# EAGLE design LEDMatrix_buffered (EAGLE 9.6.2)
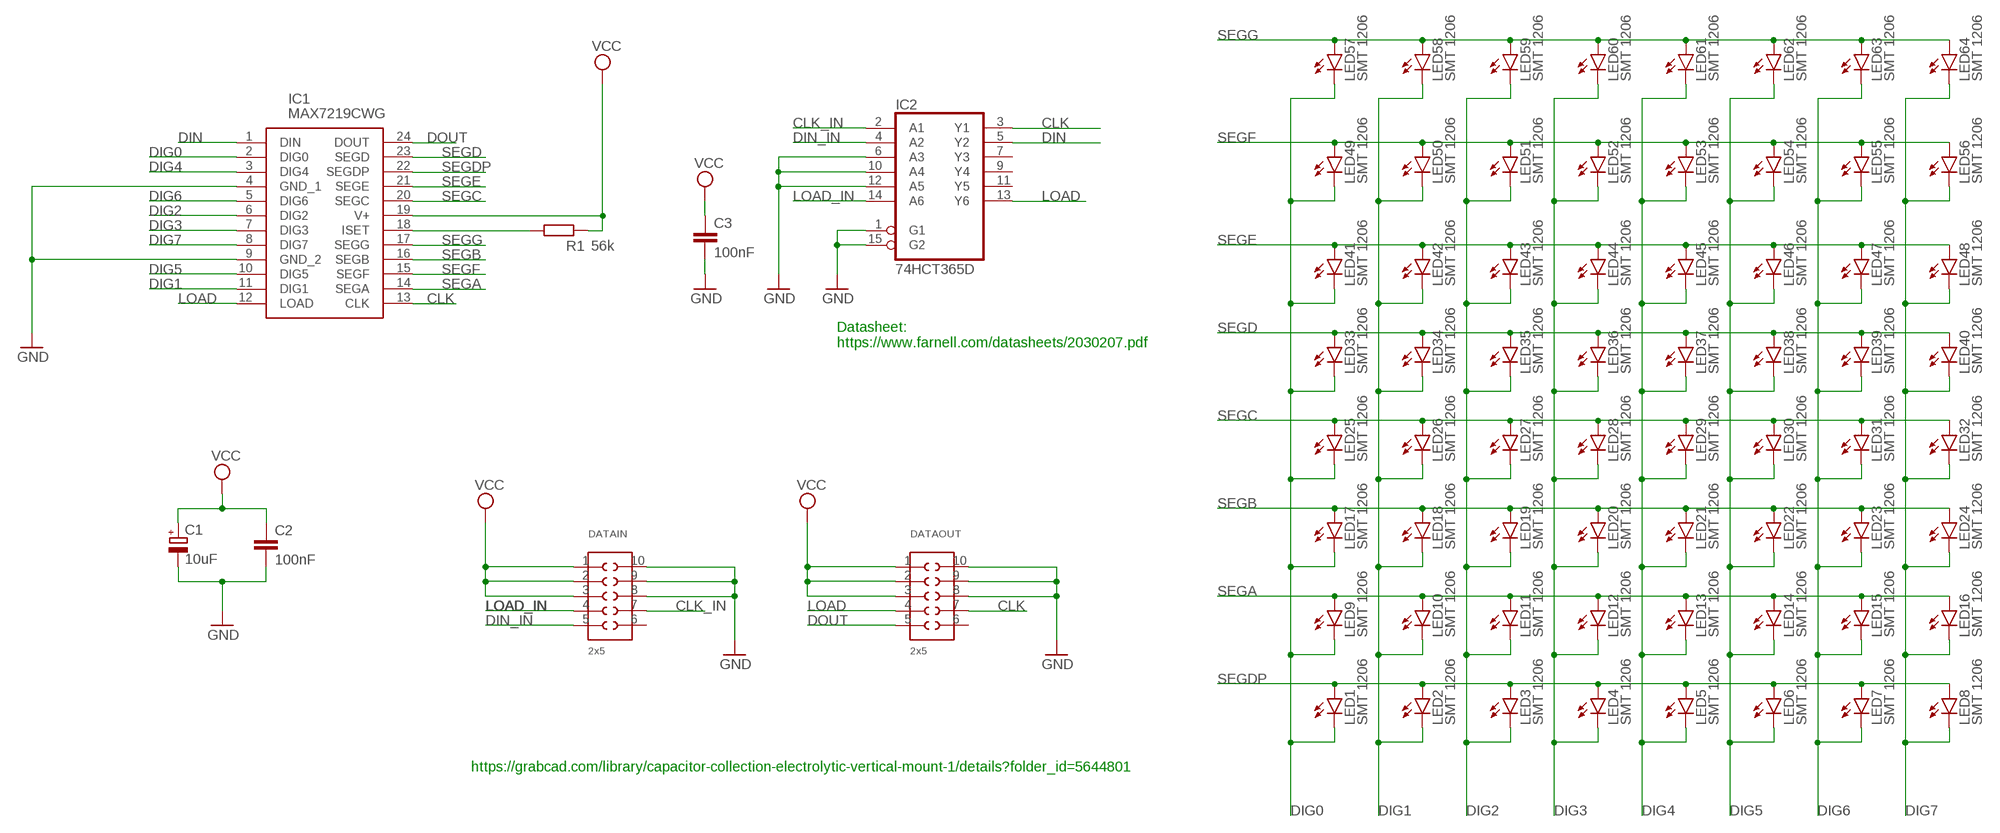
[diagram p0: schematic, sheet 1]

## Parts
C1  10uF  CPOL-EUE5-8.5  [E5-8,5]
C2  100nF  C-EUC1206  [C1206]
C3  100nF  C-EUC1206  [C1206]
DATAIN  2x5  610X1021121  [610X1021121]
DATAOUT  2x5  610X1021121  [610X1021121]
IC1  MAX7219CWG  [SOIC127P1032X265-24N]
IC2  74HCT365D  [SO16]
LED1  SMT 1206  LEDCHIPLED_1206  [CHIPLED_1206]
LED2  SMT 1206  LEDCHIPLED_1206  [CHIPLED_1206]
LED3  SMT 1206  LEDCHIPLED_1206  [CHIPLED_1206]
LED4  SMT 1206  LEDCHIPLED_1206  [CHIPLED_1206]
LED5  SMT 1206  LEDCHIPLED_1206  [CHIPLED_1206]
LED6  SMT 1206  LEDCHIPLED_1206  [CHIPLED_1206]
LED7  SMT 1206  LEDCHIPLED_1206  [CHIPLED_1206]
LED8  SMT 1206  LEDCHIPLED_1206  [CHIPLED_1206]
LED9  SMT 1206  LEDCHIPLED_1206  [CHIPLED_1206]
LED10  SMT 1206  LEDCHIPLED_1206  [CHIPLED_1206]
LED11  SMT 1206  LEDCHIPLED_1206  [CHIPLED_1206]
LED12  SMT 1206  LEDCHIPLED_1206  [CHIPLED_1206]
LED13  SMT 1206  LEDCHIPLED_1206  [CHIPLED_1206]
LED14  SMT 1206  LEDCHIPLED_1206  [CHIPLED_1206]
LED15  SMT 1206  LEDCHIPLED_1206  [CHIPLED_1206]
LED16  SMT 1206  LEDCHIPLED_1206  [CHIPLED_1206]
LED17  SMT 1206  LEDCHIPLED_1206  [CHIPLED_1206]
LED18  SMT 1206  LEDCHIPLED_1206  [CHIPLED_1206]
LED19  SMT 1206  LEDCHIPLED_1206  [CHIPLED_1206]
LED20  SMT 1206  LEDCHIPLED_1206  [CHIPLED_1206]
LED21  SMT 1206  LEDCHIPLED_1206  [CHIPLED_1206]
LED22  SMT 1206  LEDCHIPLED_1206  [CHIPLED_1206]
LED23  SMT 1206  LEDCHIPLED_1206  [CHIPLED_1206]
LED24  SMT 1206  LEDCHIPLED_1206  [CHIPLED_1206]
LED25  SMT 1206  LEDCHIPLED_1206  [CHIPLED_1206]
LED26  SMT 1206  LEDCHIPLED_1206  [CHIPLED_1206]
LED27  SMT 1206  LEDCHIPLED_1206  [CHIPLED_1206]
LED28  SMT 1206  LEDCHIPLED_1206  [CHIPLED_1206]
LED29  SMT 1206  LEDCHIPLED_1206  [CHIPLED_1206]
LED30  SMT 1206  LEDCHIPLED_1206  [CHIPLED_1206]
LED31  SMT 1206  LEDCHIPLED_1206  [CHIPLED_1206]
LED32  SMT 1206  LEDCHIPLED_1206  [CHIPLED_1206]
LED33  SMT 1206  LEDCHIPLED_1206  [CHIPLED_1206]
LED34  SMT 1206  LEDCHIPLED_1206  [CHIPLED_1206]
LED35  SMT 1206  LEDCHIPLED_1206  [CHIPLED_1206]
LED36  SMT 1206  LEDCHIPLED_1206  [CHIPLED_1206]
LED37  SMT 1206  LEDCHIPLED_1206  [CHIPLED_1206]
LED38  SMT 1206  LEDCHIPLED_1206  [CHIPLED_1206]
LED39  SMT 1206  LEDCHIPLED_1206  [CHIPLED_1206]
LED40  SMT 1206  LEDCHIPLED_1206  [CHIPLED_1206]
LED41  SMT 1206  LEDCHIPLED_1206  [CHIPLED_1206]
LED42  SMT 1206  LEDCHIPLED_1206  [CHIPLED_1206]
LED43  SMT 1206  LEDCHIPLED_1206  [CHIPLED_1206]
LED44  SMT 1206  LEDCHIPLED_1206  [CHIPLED_1206]
LED45  SMT 1206  LEDCHIPLED_1206  [CHIPLED_1206]
LED46  SMT 1206  LEDCHIPLED_1206  [CHIPLED_1206]
LED47  SMT 1206  LEDCHIPLED_1206  [CHIPLED_1206]
LED48  SMT 1206  LEDCHIPLED_1206  [CHIPLED_1206]
LED49  SMT 1206  LEDCHIPLED_1206  [CHIPLED_1206]
LED50  SMT 1206  LEDCHIPLED_1206  [CHIPLED_1206]
LED51  SMT 1206  LEDCHIPLED_1206  [CHIPLED_1206]
LED52  SMT 1206  LEDCHIPLED_1206  [CHIPLED_1206]
LED53  SMT 1206  LEDCHIPLED_1206  [CHIPLED_1206]
LED54  SMT 1206  LEDCHIPLED_1206  [CHIPLED_1206]
LED55  SMT 1206  LEDCHIPLED_1206  [CHIPLED_1206]
LED56  SMT 1206  LEDCHIPLED_1206  [CHIPLED_1206]
LED57  SMT 1206  LEDCHIPLED_1206  [CHIPLED_1206]
LED58  SMT 1206  LEDCHIPLED_1206  [CHIPLED_1206]
LED59  SMT 1206  LEDCHIPLED_1206  [CHIPLED_1206]
LED60  SMT 1206  LEDCHIPLED_1206  [CHIPLED_1206]
LED61  SMT 1206  LEDCHIPLED_1206  [CHIPLED_1206]
LED62  SMT 1206  LEDCHIPLED_1206  [CHIPLED_1206]
LED63  SMT 1206  LEDCHIPLED_1206  [CHIPLED_1206]
LED64  SMT 1206  LEDCHIPLED_1206  [CHIPLED_1206]
R1  56k  R-EU_R1206  [R1206]

## Nets
CLK: DATAOUT.7 IC1.13(CLK) IC2.3(Y1)
CLK_IN: DATAIN.7 IC2.2(A1)
DIG0: IC1.2(DIG0) LED1.C LED9.C LED17.C LED25.C LED33.C LED41.C LED49.C LED57.C
DIG1: IC1.11(DIG1) LED2.C LED10.C LED18.C LED26.C LED34.C LED42.C LED50.C LED58.C
DIG2: IC1.6(DIG2) LED3.C LED11.C LED19.C LED27.C LED35.C LED43.C LED51.C LED59.C
DIG3: IC1.7(DIG3) LED4.C LED12.C LED20.C LED28.C LED36.C LED44.C LED52.C LED60.C
DIG4: IC1.3(DIG4) LED5.C LED13.C LED21.C LED29.C LED37.C LED45.C LED53.C LED61.C
DIG5: IC1.10(DIG5) LED6.C LED14.C LED22.C LED30.C LED38.C LED46.C LED54.C LED62.C
DIG6: IC1.5(DIG6) LED7.C LED15.C LED23.C LED31.C LED39.C LED47.C LED55.C LED63.C
DIG7: IC1.8(DIG7) LED8.C LED16.C LED24.C LED32.C LED40.C LED48.C LED56.C LED64.C
DIN: IC1.1(DIN) IC2.5(Y2)
DIN_IN: DATAIN.5 IC2.4(A2)
DOUT: DATAOUT.5 IC1.24(DOUT)
GND: C1.- C2.2 C3.2 DATAIN.8 DATAIN.9 DATAIN.10 DATAOUT.8 DATAOUT.9 DATAOUT.10 IC1.4(GND_1) IC1.9(GND_2) IC2.1(G1) IC2.6(A3) IC2.10(A4) IC2.12(A5) IC2.15(G2)
LOAD: DATAOUT.4 IC1.12(LOAD) IC2.13(Y6)
LOAD_IN: DATAIN.4 IC2.14(A6)
N$2: IC1.18(ISET) R1.1
SEGA: IC1.14(SEGA) LED9.A LED10.A LED11.A LED12.A LED13.A LED14.A LED15.A LED16.A
SEGB: IC1.16(SEGB) LED17.A LED18.A LED19.A LED20.A LED21.A LED22.A LED23.A LED24.A
SEGC: IC1.20(SEGC) LED25.A LED26.A LED27.A LED28.A LED29.A LED30.A LED31.A LED32.A
SEGD: IC1.23(SEGD) LED33.A LED34.A LED35.A LED36.A LED37.A LED38.A LED39.A LED40.A
SEGDP: IC1.22(SEGDP) LED1.A LED2.A LED3.A LED4.A LED5.A LED6.A LED7.A LED8.A
SEGE: IC1.21(SEGE) LED41.A LED42.A LED43.A LED44.A LED45.A LED46.A LED47.A LED48.A
SEGF: IC1.15(SEGF) LED49.A LED50.A LED51.A LED52.A LED53.A LED54.A LED55.A LED56.A
SEGG: IC1.17(SEGG) LED57.A LED58.A LED59.A LED60.A LED61.A LED62.A LED63.A LED64.A
VCC: C1.+ C2.1 C3.1 DATAIN.1 DATAIN.2 DATAIN.3 DATAOUT.1 DATAOUT.2 DATAOUT.3 IC1.19(V+) R1.2
Unconnected: DATAIN.6 DATAOUT.6 IC2.7(Y3) IC2.9(Y4) IC2.11(Y5)

## Notes on the sheet
- Datasheet:
  https://www.farnell.com/datasheets/2030207.pdf
- https://grabcad.com/library/capacitor-collection-electrolytic-vertical-mount-1/details?folder_id=5644801

## Power pins joined to a net without a drawn wire
GND: IC2.8(GND)
VCC: IC2.16(VCC)

## Library data of the parts
C1 = Clean-Kong:CPOL-EU: POLARIZED CAPACITOR, European symbol
C2 C3 = rcl:C-EU: CAPACITOR, European symbol; SPICEPREFIX: C
DATAIN DATAOUT = Wurth_Elektronik_Electromechanic_Board_to_Board_Connectors_rev16a:610X1021121: WR-PHD 2.54mm Dual SMT Pin Header, 10 Pins =>Code : Con_BTB_PHD_2.54_2_610x1021121(packageing:x = 0: Tube x = 3: Tape & Reel with Cap; 300 pcs/Reel) <http://katalog.we-online.de/media/images/eican/Con_BTB_PHD_2.54_2_6100xx21121_pf2.jpg> 6100xx21121 Details see: http://katalog.we-online.de/en/em/610_0xx_211_21 6103xx21121 Details see: http://katalog.we-online.de/en/em/PHD_2_54_SMT_DUAL_PIN_HEADER_REEL_6103XX21121 2014 (C) Würth Elektronik
IC1 = MAX7219CWG:MAX7219CWG: IC DRVR 7 SEGMNT 8 DIGIT 24SOIC Source: Datasheet <http://datasheets.maximintegrated.com/en/ds/MAX7219-MAX7221.pdf>; DESCRIPTION: IC DRVR 7 SEGMNT 8 DIGIT 24SOIC; HEIGHT: 2.65mm; MANUFACTURER_NAME: Maxim Integrated; MANUFACTURER_PART_NUMBER: MAX7219CWG
IC2 = 74xx-eu:74*365: Hex BUS DRIVER, 3-state; SPICEPREFIX: X
LED1-LED64 = led:LED: LED OSRAM: - CHIPLED LG R971, LG N971, LY N971, LG Q971, LY Q971, LO R971, LY R971 LH N974, LH R974 LS Q976, LO Q976, LY Q976 LO Q996 - Hyper CHIPLED LW Q18S LB Q993, LB Q99A, LB R99A - SideLED LS A670, LO A670, LY A670, LG A670, LP A670 LB A673, LV A673, LT A673, LW A673 LH A674 LY A675 LS A676, LA A676, LO A676, LY A676, LW A676 LS A679, LY A679, LG A679 - Hyper Micro SIDELED® LS Y876, LA Y876, LO Y876, LY Y876 LT Y87S - SmartLED LW L88C, LW L88S LB L89C, LB L89S, LG L890 LS L89K, LO L89K, LY L89K LS L896, LA L896, LO L896, LY L896 - TOPLED LS T670, LO T670, LY T670, LG T670, LP T670 LSG T670, LSP T670, LSY T670, LOP T670, LYG T670 LG T671, LOG T671, LSG T671 LB T673, LV T673, LT T673, LW T673 LH T674 LS T676, LA T676, LO T676, LY T676, LB T676, LH T676, LSB T676, LW T676 LB T67C, LV T67C, LT T67C, LS T67K, LO T67K, LY T67K, LW E67C LS E67B, LA E67B, LO E67B, LY E67B, LB E67C, LV E67C, LT E67C LW T67C LS T679, LY T679, LG T679 LS T770, LO T770, LY T770, LG T770, LP T770 LB T773, LV T773, LT T773, LW T773 LH T774 LS E675, LA E675, LY E675, LS T675 LS T776, LA T776, LO T776, LY T776, LB T776 LHGB T686 LT T68C, LB T68C - Hyper Mini TOPLED® LB M676 - Mini TOPLED Santana® LG M470 LS M47K, LO M47K, LY M47K Source: http://www.osram.convergy.de LUXEON: - LUMILED® LXK2-PW12-R00, LXK2-PW12-S00, LXK2-PW14-U00, LXK2-PW14-V00 LXK2-PM12-R00, LXK2-PM12-S00, LXK2-PM14-U00 LXK2-PE12-Q00, LXK2-PE12-R00, LXK2-PE12-S00, LXK2-PE14-T00, LXK2-PE14-U00 LXK2-PB12-K00, LXK2-PB12-L00, LXK2-PB12-M00, LXK2-PB14-N00, LXK2-PB14-P00, LXK2-PB14-Q00 LXK2-PR12-L00, LXK2-PR12-M00, LXK2-PR14-Q00, LXK2-PR14-R00 LXK2-PD12-Q00, LXK2-PD12-R00, LXK2-PD12-S00 LXK2-PH12-R00, LXK2-PH12-S00 LXK2-PL12-P00, LXK2-PL12-Q00, LXK2-PL12-R00 Source: www.luxeon.com KINGBRIGHT: KA-3528ASYC Source: www.kingbright.com
R1 = rcl:R-EU_: RESISTOR, European symbol; SPICEPREFIX: R

## Board
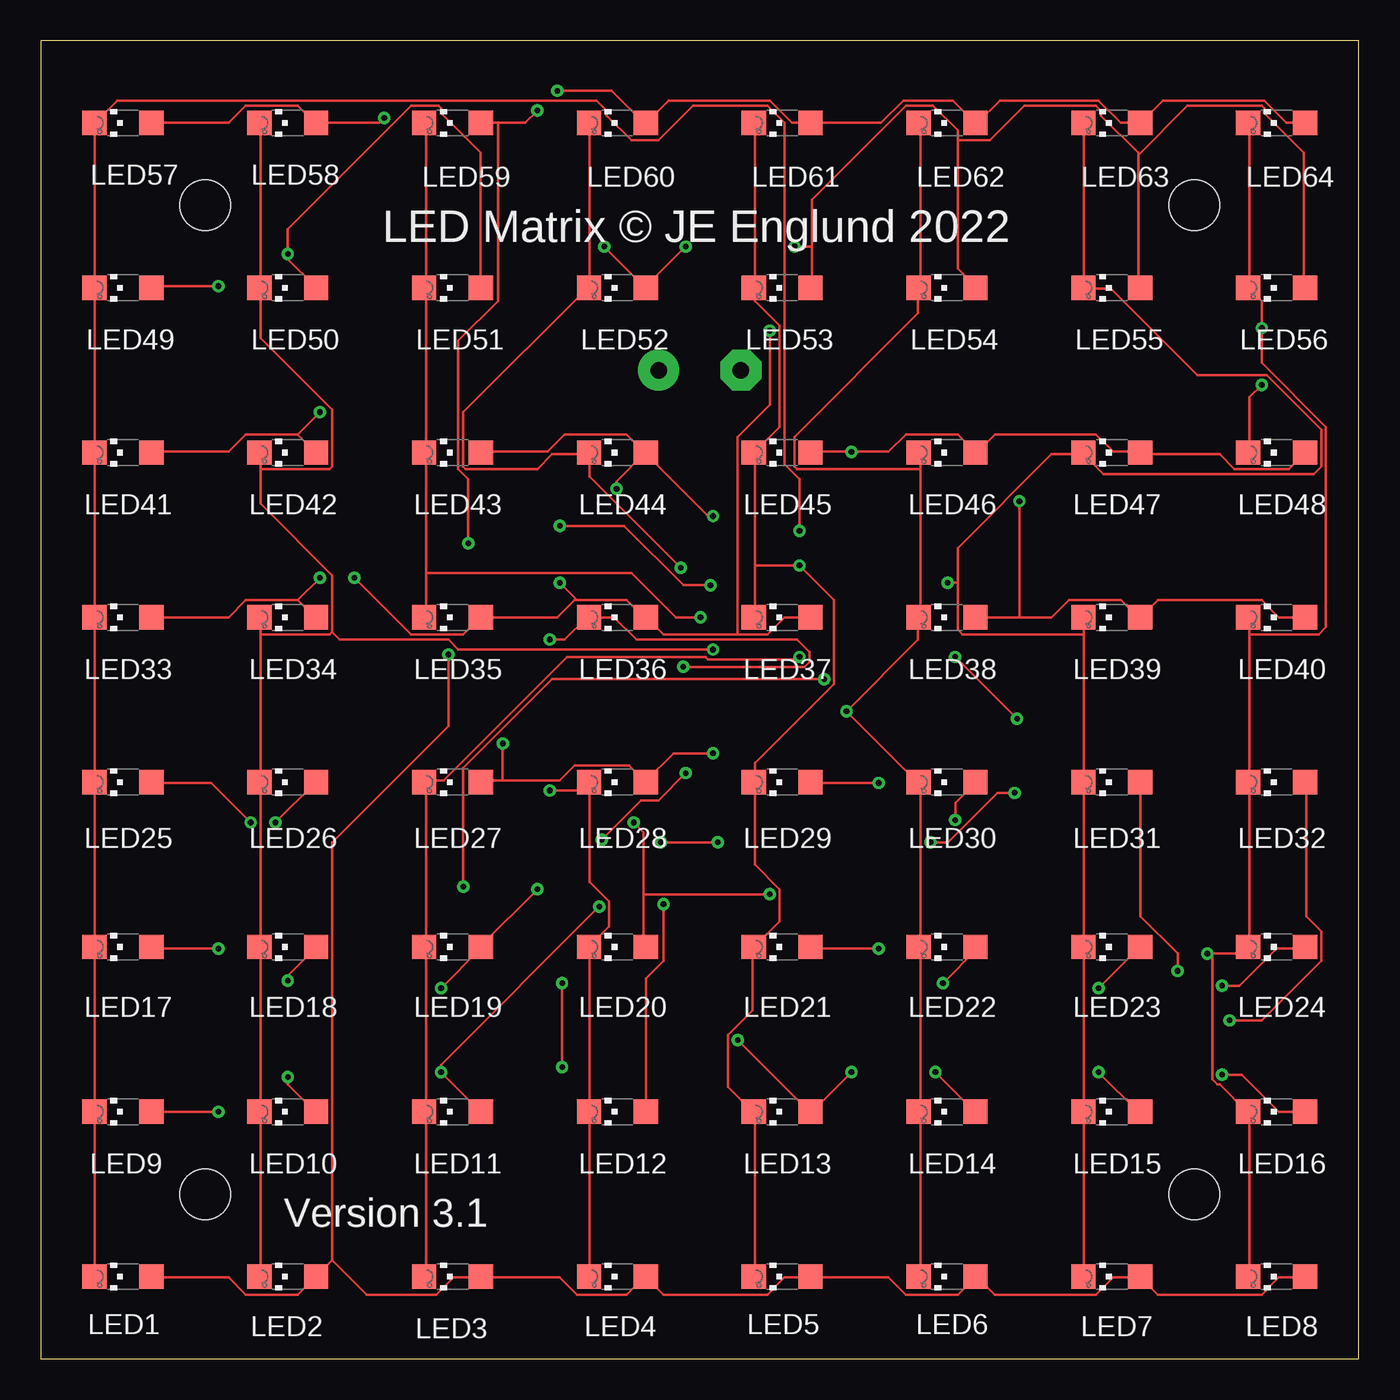
[diagram p1: board, top side]
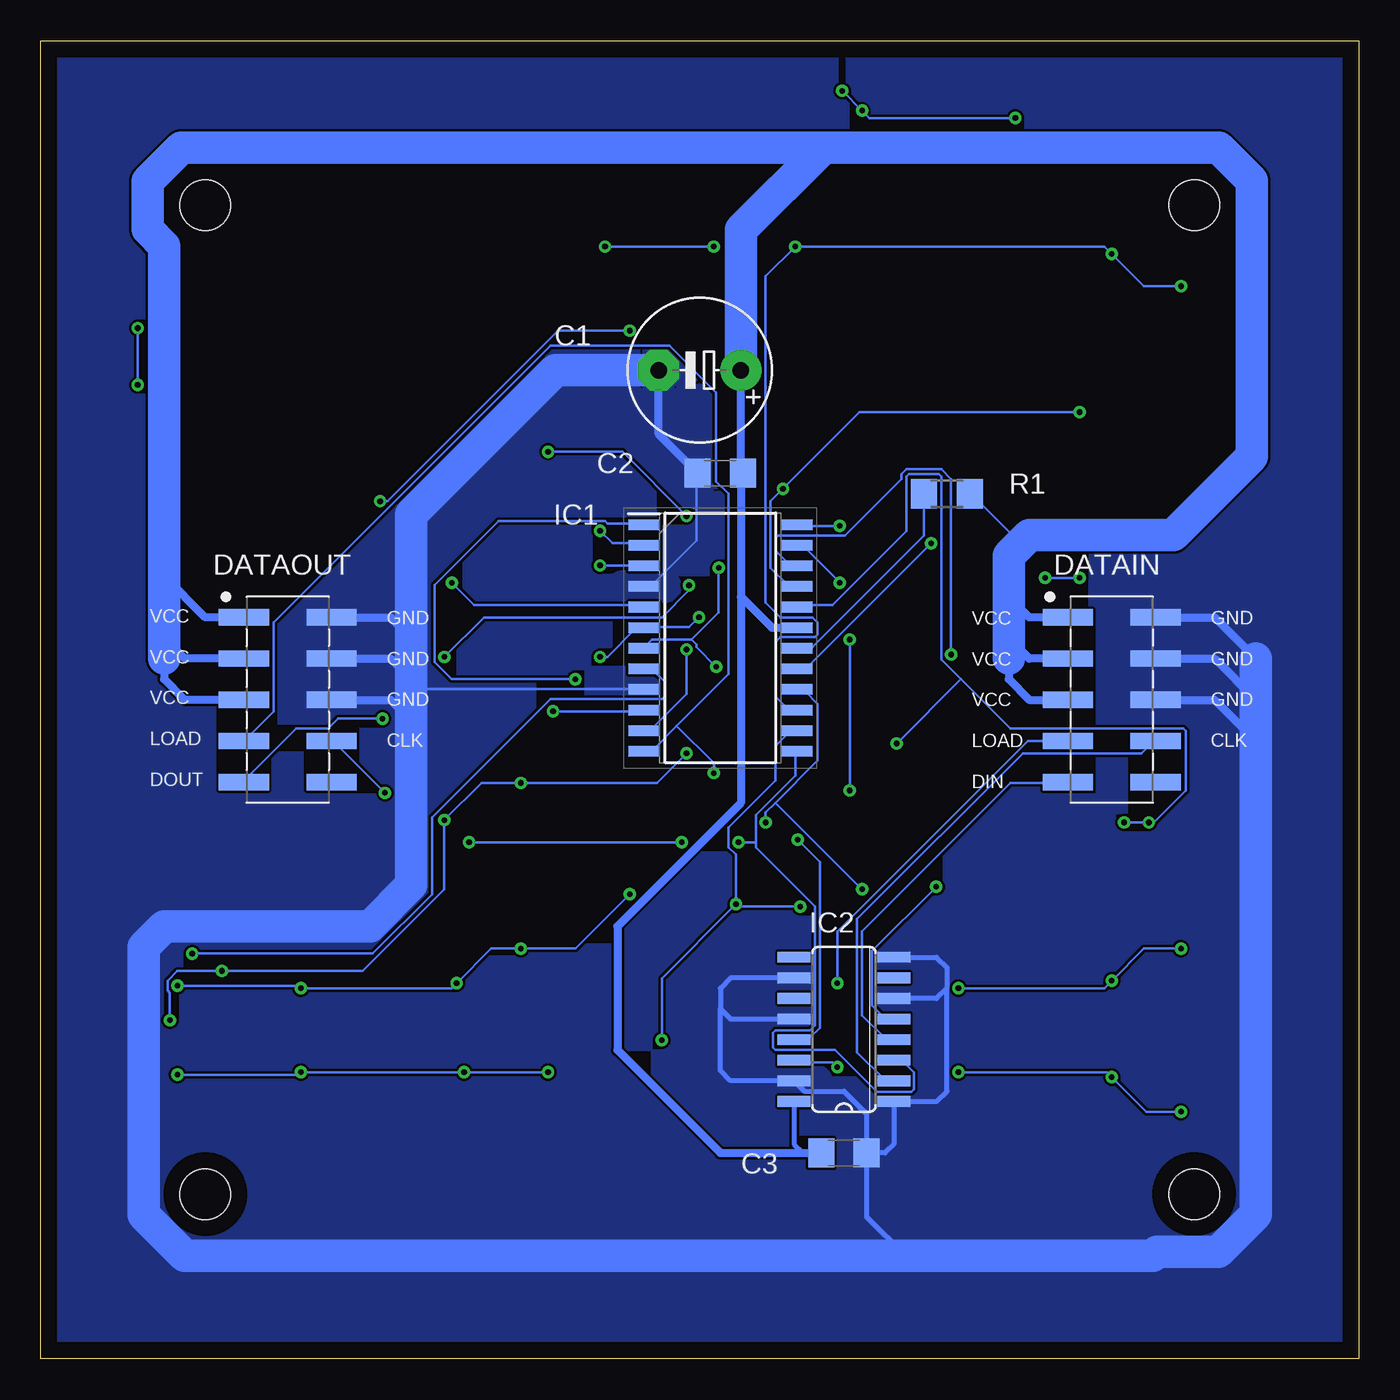
[diagram p2: board, bottom side, seen from below]

Size 81.28 x 81.28 mm. Coordinates in mm from the lower left corner, seen from the top.
Outline: 0,0 81.28,0 81.28,81.28 0,81.28 0,0
Copper layers (1*16): Top 0.035mm / dielectric 1.5mm / Bottom 0.035mm
Design rules "default *": minimum track width 6mil, minimum drill 0.35mm, track to track 6mil, track to pad 6mil, pad to pad 6mil, via to via 50mil, smd to smd 6mil, copper to edge 40mil, drill to drill 6mil, minimum pad ring 10mil, minimum via ring 8mil, stop-mask expansion 4mil, vias tented up to drill 0mil, thermal gap 10mil
Holes 3.1 mm at 10.16,71.12 71.12,71.12 71.12,10.16 10.16,10.16

### Footprints (pad centres in the part's own frame; a part is rotated, then mirrored left to right if it is on the bottom)
E5-8,5 = drill 1.016 pad 2.54: + -2.54,0 | drill 1.016 pad 2.54 octagon: - 2.54,0
C1206 = smd 1.6 x 1.8: 1 -1.4,0; 2 1.4,0
610X1021121 = smd 1 x 3.1: 1 -5.08,-2.7; 2 -2.54,-2.7; 3 0,-2.7; 4 2.54,-2.7; 5 5.08,-2.7; 6 5.08,2.7; 7 2.54,2.7; 8 0,2.7; 9 -2.54,2.7; 10 -5.08,2.7
SOIC127P1032X265-24N = smd 1.925 x 0.65: 1 -4.712,6.985; 2 -4.712,5.715; 3 -4.712,4.445; 4 -4.712,3.175; 5 -4.712,1.905; 6 -4.712,0.635; 7 -4.712,-0.635; 8 -4.712,-1.905; 9 -4.712,-3.175; 10 -4.712,-4.445; 11 -4.712,-5.715; 12 -4.712,-6.985; 13 4.712,-6.985; 14 4.712,-5.715; 15 4.712,-4.445; 16 4.712,-3.175; 17 4.712,-1.905; 18 4.712,-0.635; 19 4.712,0.635; 20 4.712,1.905; 21 4.712,3.175; 22 4.712,4.445; 23 4.712,5.715; 24 4.712,6.985
SO16 = smd 0.66 x 2.032: 1 -4.445,-3.073; 2 -3.175,-3.073; 3 -1.905,-3.073; 4 -0.635,-3.073; 5 0.635,-3.073; 6 1.905,-3.073; 7 3.175,-3.073; 8 4.445,-3.073; 9 4.445,3.073; 10 3.175,3.073; 11 1.905,3.073; 12 0.635,3.073; 13 -0.635,3.073; 14 -1.905,3.073; 15 -3.175,3.073; 16 -4.445,3.073
CHIPLED_1206 = smd 1.5 x 1.5: A 0,-1.75; C 0,1.75
R1206 = smd 1.6 x 1.803: 1 -1.422,0; 2 1.422,0

### Placement (x,y rotation side)
C1  40.64,60.96 180 bottom
C2  39.37,54.61 180 bottom
C3  31.75,12.7 0 bottom
DATAIN  15.24,40.64 270 bottom
DATAOUT  66.04,40.64 270 bottom
IC1  39.37,44.45 0 bottom
IC2  31.75,20.32 90 bottom
LED1  5.08,5.08 90 top
LED2  15.24,5.08 90 top
LED3  25.4,5.08 90 top
LED4  35.56,5.08 90 top
LED5  45.72,5.08 90 top
LED6  55.88,5.08 90 top
LED7  66.04,5.08 90 top
LED8  76.2,5.08 90 top
LED9  5.08,15.24 90 top
LED10  15.24,15.24 90 top
LED11  25.4,15.24 90 top
LED12  35.56,15.24 90 top
LED13  45.72,15.24 90 top
LED14  55.88,15.24 90 top
LED15  66.04,15.24 90 top
LED16  76.2,15.24 90 top
LED17  5.08,25.4 90 top
LED18  15.24,25.4 90 top
LED19  25.4,25.4 90 top
LED20  35.56,25.4 90 top
LED21  45.72,25.4 90 top
LED22  55.88,25.4 90 top
LED23  66.04,25.4 90 top
LED24  76.2,25.4 90 top
LED25  5.08,35.56 90 top
LED26  15.24,35.56 90 top
LED27  25.4,35.56 90 top
LED28  35.56,35.56 90 top
LED29  45.72,35.56 90 top
LED30  55.88,35.56 90 top
LED31  66.04,35.56 90 top
LED32  76.2,35.56 90 top
LED33  5.08,45.72 90 top
LED34  15.24,45.72 90 top
LED35  25.4,45.72 90 top
LED36  35.56,45.72 90 top
LED37  45.72,45.72 90 top
LED38  55.88,45.72 90 top
LED39  66.04,45.72 90 top
LED40  76.2,45.72 90 top
LED41  5.08,55.88 90 top
LED42  15.24,55.88 90 top
LED43  25.4,55.88 90 top
LED44  35.56,55.88 90 top
LED45  45.72,55.88 90 top
LED46  55.88,55.88 90 top
LED47  66.04,55.88 90 top
LED48  76.2,55.88 90 top
LED49  5.08,66.04 90 top
LED50  15.24,66.04 90 top
LED51  25.4,66.04 90 top
LED52  35.56,66.04 90 top
LED53  45.72,66.04 90 top
LED54  55.88,66.04 90 top
LED55  66.04,66.04 90 top
LED56  76.2,66.04 90 top
LED57  5.08,76.2 90 top
LED58  15.24,76.2 90 top
LED59  25.4,76.2 90 top
LED60  35.56,76.2 90 top
LED61  45.72,76.2 90 top
LED62  55.88,76.2 90 top
LED63  66.04,76.2 90 top
LED64  76.2,76.2 90 top
R1  25.4,53.34 0 bottom

### Tracks (layer width: path | path; a pad name or v marks a point on that pad's centre or on a via)
CLK  (via drill 0.35)
  Top 0.152: v60.05,34.9 58.98,34.9 55.93,31.85 v54.86,31.85 | v38.25,31.85 v41.76,31.85
  Bottom 0.152: 37.19,31.85 37.19,31.55 33.53,27.89 33.53,20.57 33.83,20.27 35.97,20.27 36.12,20.12 36.12,19.2 35.97,19.05 32.31,19.05 29.72,16.46 27.58,16.46 27.43,16.61 27.43,17.68 28.04,18.29 28.65,18.29 IC2.3 | 37.19,31.85 37.19,33.53 34.75,35.97 34.75,37.34 IC1.13 | v60.05,34.9 63.25,38.1 DATAOUT.7 | v41.76,31.85 v54.86,31.85 | 37.19,31.85 v38.25,31.85
CLK_IN
  Bottom 0.152: IC2.2 28.8,17.22 29.26,17.22 30.94,18.9 30.94,27.13 20.73,37.34 13.41,37.34 12.65,38.1 DATAIN.7
DIG0  (via drill 0.35)
  Top 0.152: 3.35,45.72 3.35,55.78 LED41.C 3.35,55.93 3.35,65.99 LED49.C 3.35,66.14 3.35,76.2 | 3.35,15.24 3.35,5.18 LED1.C | 3.35,15.24 3.35,25.3 LED17.C 3.35,25.45 3.35,35.51 LED25.C 3.35,35.66 3.35,45.72 | 3.35,15.24 LED9.C | 3.35,45.72 LED33.C | v46.79,51.05 46.79,54.25 45.87,55.17 45.87,76.2 44.81,77.27 40.23,77.27 38.1,75.13 36.42,75.13 34.9,76.66 34.9,76.96 34.29,77.57 4.72,77.57 3.35,76.2 | 3.35,76.2 LED57.C
  Bottom 0.152: v46.79,51.05 46.02,50.29 44.2,50.29 IC1.2
DIG1  (via drill 0.35)
  Top 0.152: LED58.C 13.56,76.2 13.56,66.14 LED50.C 13.56,65.99 13.56,62.94 17.98,58.52 17.98,55.02 17.83,54.86 13.56,54.86 | 13.56,15.24 13.56,5.18 LED2.C | 13.56,44.65 13.56,35.66 LED26.C 13.56,35.51 13.56,25.45 LED18.C 13.56,25.3 13.56,15.24 | 13.56,44.65 13.56,45.72 LED34.C | 13.56,54.86 13.56,52.73 17.98,48.31 17.98,44.81 | 13.56,54.86 13.56,55.78 LED42.C | 17.98,44.81 17.83,44.65 13.56,44.65 | v41.45,43.74 25.76,43.74 25.15,44.35 18.44,44.35 17.98,44.81 | 13.56,15.24 LED10.C
  Bottom 0.152: v41.45,43.74 41.45,41 43.59,38.86 44.04,38.86 IC1.11
DIG2  (via drill 0.35)
  Top 0.152: 23.77,15.24 23.77,5.18 LED3.C | 23.77,15.24 23.77,25.3 LED19.C 23.77,25.45 23.77,35.51 LED27.C 23.77,35.66 24.84,35.66 32.46,43.28 41,43.28 41.15,43.13 46.63,43.13 v46.79,43.28 | 23.77,15.24 LED11.C | LED59.C 23.77,76.2 23.77,66.14 LED51.C 23.77,65.99 23.77,55.93 LED43.C 23.77,55.78 23.77,48.46 | 23.77,48.46 23.77,45.72 LED35.C | v40.69,45.72 39.17,45.72 36.42,48.46 23.77,48.46
  Bottom 0.152: v40.69,45.72 41.3,45.11 44.04,45.11 IC1.6 44.2,44.96 44.65,44.96 46.33,43.28 v46.79,43.28
DIG3  (via drill 0.35)
  Top 0.152: 33.83,15.24 33.83,5.18 LED4.C | 33.83,15.24 33.83,25.3 LED20.C 33.83,25.45 35.05,26.67 35.05,28.19 33.83,29.41 33.83,35.05 | 33.83,15.24 LED12.C | 33.83,35.05 33.83,35.51 LED28.C 33.83,35.05 | v39.62,42.67 47.09,42.67 47.4,42.98 47.4,43.59 46.63,44.35 36.73,44.35 35.36,45.72 LED36.C 33.68,45.72 32.31,44.35 v31.39,44.35 | LED60.C 33.83,76.2 33.83,66.14 LED52.C 33.68,65.99 26.06,58.37 26.06,55.02 26.21,54.86 30.63,54.86 31.55,55.78 33.68,55.78 LED44.C 33.83,55.78 33.83,54.41 v39.47,48.77 | v31.39,35.05 33.83,35.05
  Bottom 0.152: v39.62,42.67 40.84,43.89 40.84,44.04 41.15,44.35 | 41.15,44.35 43.59,44.35 44.04,43.89 IC1.7 | 41.15,44.35 39.47,46.02 v39.47,48.77 | v31.39,44.35 v31.39,35.05
DIG4  (via drill 0.35)
  Top 0.152: LED5.C 44.04,5.18 44.04,15.24 LED13.C 43.89,15.24 42.37,16.76 42.37,19.96 43.89,21.49 43.89,25.3 LED21.C 44.04,25.45 45.57,26.98 45.57,28.96 44.04,30.48 44.04,35.51 LED29.C 44.04,35.66 44.04,36.73 48.92,41.6 48.92,46.79 v46.79,48.92 44.04,48.92 | LED61.C 44.04,76.2 44.04,66.14 LED53.C 44.04,65.99 44.04,65.23 45.57,63.7 45.57,57.45 44.04,55.93 LED45.C 44.04,55.78 44.04,48.92 | 44.04,48.92 44.04,45.72 LED37.C
  Bottom 0.152: v46.79,48.92 44.2,48.92 IC1.3
DIG5  (via drill 0.35)
  Top 0.152: LED62.C 54.25,76.2 54.25,66.14 LED54.C 54.1,65.99 54.1,64.47 46.48,56.84 46.48,55.02 46.63,54.86 54.25,54.86 | 54.25,54.86 54.25,55.78 LED46.C | 54.25,54.86 54.25,45.72 LED38.C 54.1,45.72 54.1,44.35 v49.68,39.93 54.1,35.51 LED30.C 54.25,35.51 54.25,25.45 LED22.C 54.25,25.3 54.25,15.24 | 54.25,15.24 54.25,5.18 LED6.C | 54.25,15.24 LED14.C
  Bottom 0.152: v49.68,39.93 44.2,39.93 IC1.10
DIG6  (via drill 0.35)
  Top 0.152: LED63.C 64.31,76.2 64.31,66.14 LED55.C 64.31,65.99 65.99,65.99 71.32,60.66 75.59,60.66 78.94,57.3 78.94,55.02 78.49,54.56 65.53,54.56 64.31,55.78 LED47.C 64.16,55.78 62.33,55.78 56.54,49.99 56.54,47.85 | 64.31,15.24 64.31,5.18 LED7.C | 64.31,44.65 64.31,35.66 LED31.C 64.31,35.51 64.31,25.45 LED23.C 64.31,25.3 64.31,15.24 | 64.31,44.65 64.31,45.72 LED39.C | 56.54,47.85 56.54,44.96 56.84,44.65 64.31,44.65 | 56.54,47.85 v55.93,47.85 | 64.31,15.24 LED15.C
  Bottom 0.152: v55.93,47.85 54.56,46.48 44.2,46.48 IC1.5
DIG7  (via drill 0.35)
  Top 0.152: v75.29,60.05 74.52,59.28 74.52,55.93 LED48.C | LED64.C 74.52,76.2 74.52,66.14 LED56.C 74.52,65.99 75.29,65.23 v75.29,63.55 75.29,61.42 79.25,57.45 79.25,45.11 78.79,44.65 74.52,44.65 | LED8.C 74.52,5.18 74.52,15.24 LED16.C 74.37,15.24 72.69,16.92 72.54,16.92 72.24,17.22 72.24,24.99 | 74.52,44.65 74.52,35.66 LED32.C 74.52,35.51 74.52,25.45 LED24.C 74.37,25.3 74.07,24.99 72.24,24.99 | 74.52,44.65 74.52,45.72 LED40.C | 72.24,24.99 v71.93,24.99
  Bottom 0.152: v75.29,63.55 v75.29,60.05 | v71.93,24.99 60.81,24.99 57.15,28.65 57.15,33.38 49.84,40.69 42.98,40.69 42.82,40.84 42.82,41.76 43.59,42.52 44.04,42.52 IC1.8
DIN  (via drill 0.35)
  Top 0.152: v48.31,41.91 31.55,41.91 26.06,36.42 v26.06,29.11
  Bottom 0.152: v48.31,41.91 55.93,41.91 57,42.98 57,47.7 53.03,51.66 46.48,51.66 46.33,51.51 44.2,51.51 IC1.1 | v26.06,29.11 30.02,25.15 30.02,21.79 29.26,21.03 28.8,21.03 IC2.5
DIN_IN
  Bottom 0.152: IC2.4 28.8,19.81 29.26,19.81 30.63,21.18 30.63,26.36 21.49,35.51 17.98,35.51 DATAIN.5
DOUT  (via drill 0.35)
  Top 0.152: v32,51.36 35.97,51.36 39.62,47.7 v41.3,47.7 | v60.2,39.47 v56.39,43.28
  Bottom 0.152: v32,51.36 34.59,51.36 IC1.24 | v41.3,47.7 41.3,47.4 42.98,45.72 53.95,45.72 v56.39,43.28 | v60.2,39.47 62.94,39.47 63.55,38.86 65.53,38.86 68.73,35.66 DATAOUT.5
GND
  Bottom 0.152: 58.42,41.3 44.2,41.3 IC1.9 | IC1.4 44.04,47.7 43.59,47.7 40.84,50.44 40.84,54.41 C2.2
  Bottom 0.3: IC2.8 26.04,24.77 25.4,24.13 25.4,22.86 | 25.4,22.86 26.04,22.23 IC2.6 | 25.4,22.86 25.4,16.51 26.04,15.88 IC2.1 28.68,13.23 29.21,12.7 C3.2 | IC2.10 38.73,23.5 39.37,22.86 39.37,21.59 | 39.37,21.59 38.73,20.95 IC2.12 | 39.37,21.59 39.37,17.78 38.73,17.14 IC2.15 34.19,16.51 31.75,16.51 30.35,15.11 C3.2 | C3.2 30.35,8.76 27.94,6.35
  Bottom 0.5: 6.35,40.64 6.35,43.18 8.89,45.72 DATAIN.10 | 6.35,40.64 6.35,38.1 8.89,40.64 DATAIN.8 | DATAIN.9 8.89,43.18 6.35,40.64 | DATAOUT.10 59.69,45.72 58.42,44.45 58.42,43.18 58.42,41.91 | 58.42,41.91 58.42,41.3 58.42,39.37 59.69,40.64 DATAOUT.8 | DATAOUT.9 59.69,43.18 58.42,41.91 | C2.2 43.18,57.02 C1.-
  Bottom 2: 6.35,43.18 6.35,8.93 8.68,6.59 12.46,6.59 12.7,6.35 27.94,6.35 72.39,6.35 74.93,8.89 74.93,25.4 73.66,26.67 60.96,26.67 58.42,29.21 58.42,41.3 58.42,43.18 58.42,52.07 49.53,60.96 C1.-
  pour Bottom: 0,81.28 81.28,81.28 81.28,0 0,0
LOAD  (via drill 0.35)
  Top 0.152: v34.59,32 37.03,34.44 38.1,34.44 v39.78,36.12
  Bottom 0.152: 42.06,39.01 38.86,42.22 38.86,53.34 39.62,54.1 39.62,59.59 42.52,62.48 49.84,62.48 66.9,45.41 66.9,39.93 DATAOUT.4 | 42.06,39.01 43.59,37.49 44.04,37.49 IC1.12 | v34.59,32 33.22,30.63 33.22,20.42 33.83,19.81 34.75,19.81 IC2.13 | v39.78,36.12 39.78,36.73 42.06,39.01
LOAD_IN  (via drill 0.35)
  Top 0.152: v32.16,23.16 v32.16,17.98
  Bottom 0.152: v32.16,17.98 32.46,18.29 34.75,18.29 IC2.14 | v32.16,23.16 32.16,26.36 20.42,38.1 DATAIN.4
N$2
  Bottom 0.152: R1.1 26.82,50.75 33.68,43.89 34.59,43.89 IC1.18 | R1.1
SEGA  (via drill 0.35)
  Top 0.152: v10.97,15.24 LED9.A | v15.24,17.37 15.24,16.92 16.92,15.24 LED10.A | LED11.A 27.13,15.24 v24.69,17.68 24.69,18.14 v34.44,27.89 | v38.41,28.04 38.41,24.54 37.34,23.47 37.34,15.24 LED12.A | v42.98,19.66 47.4,15.24 LED13.A 47.55,15.24 v49.99,17.68 | v55.17,17.68 57.61,15.24 LED14.A | v65.23,17.68 67.67,15.24 LED15.A | LED16.A 76.35,15.24 74.07,17.53 v72.85,17.53
  Bottom 0.152: v10.97,15.24 13.11,15.24 v15.24,17.37 15.54,17.68 v24.69,17.68 | IC1.14 34.75,38.71 35.05,38.71 35.97,37.8 35.97,35.66 38.86,32.77 38.86,31.55 38.41,31.09 v38.41,28.04 38.56,27.89 | v42.98,19.66 42.98,23.47 38.56,27.89 | v49.99,17.68 v55.17,17.68 v65.23,17.68 65.38,17.53 v72.85,17.53 | 38.56,27.89 v34.44,27.89
SEGB  (via drill 0.35)
  Top 0.152: v51.66,25.3 47.55,25.3 LED21.A | v55.63,23.16 57.76,25.3 LED22.A | v65.23,22.86 67.67,25.3 LED23.A | v72.85,23.01 73.91,23.01 76.2,25.3 77.88,25.3 LED24.A | 37.19,28.65 37.19,32.46 v36.58,33.07 | 37.19,28.65 37.19,25.45 LED20.A | v10.97,25.3 6.86,25.3 LED17.A | v15.24,23.32 15.24,23.62 16.92,25.3 LED18.A | v24.69,22.86 27.13,25.3 LED19.A 27.13,25.45 v30.63,28.96 | 37.19,28.65 v44.96,28.65
  Bottom 0.152: v72.85,23.01 65.38,23.01 v65.23,22.86 55.93,22.86 v55.63,23.16 53.49,25.3 v51.66,25.3 48.31,25.3 v44.96,28.65 | v36.58,33.07 36.58,33.68 35.97,34.29 | 35.97,34.29 33.38,36.88 33.38,40.39 34.14,41.15 34.59,41.15 IC1.16 | v10.97,25.3 13.26,25.3 v15.24,23.32 15.7,22.86 v24.69,22.86 | v30.63,28.96 35.97,34.29
SEGC  (via drill 0.35)
  Top 0.152: v51.66,35.51 47.55,35.51 LED29.A | v56.39,33.22 56.39,34.29 57.61,35.51 LED30.A | v70.1,23.93 70.1,24.99 67.82,27.28 67.82,35.51 LED31.A | v73.3,20.88 75.29,20.88 78.94,24.54 78.94,26.36 78.03,27.28 78.03,35.51 LED32.A | 28.5,35.66 32,35.66 32.92,36.58 36.27,36.58 37.19,35.66 LED28.A 37.34,35.66 39.01,37.34 v41.45,37.34 | 28.5,35.66 27.28,35.66 LED27.A | v12.95,33.07 10.52,35.51 6.86,35.51 LED25.A | v14.48,33.07 16.92,35.51 LED26.A | v28.5,37.95 28.5,35.66
  Bottom 0.152: v73.3,20.88 73.3,22.55 73.46,22.71 73.46,23.32 72.85,23.93 v70.1,23.93 61.42,23.93 56.39,28.96 v56.39,33.22 54.1,35.51 v51.66,35.51 43.28,35.51 v41.45,37.34 | v14.48,33.07 v12.95,33.07 12.65,33.07 10.67,35.05 10.67,38.71 10.82,38.86 21.49,38.86 24.54,41.91 | 24.54,41.91 25.76,43.13 25.76,54.41 25.91,54.56 27.74,54.56 27.89,54.41 27.89,51.05 32.46,46.48 34.59,46.48 IC1.20 | 24.54,41.91 v28.5,37.95
SEGD  (via drill 0.35)
  Top 0.152: 60.35,45.72 62.33,45.72 63.4,46.79 66.6,46.79 67.67,45.72 LED39.A 67.82,45.72 68.89,46.79 75.29,46.79 76.35,45.72 LED40.A | 60.35,45.72 LED38.A | LED33.A 11.58,45.72 12.65,46.79 15.85,46.79 | 15.85,46.79 16.92,45.72 LED34.A | 33.07,46.79 36.12,46.79 37.19,45.72 LED36.A 37.34,45.72 38.41,44.65 42.98,44.65 | 33.07,46.79 32.92,46.79 31.85,45.72 LED35.A 27.13,45.72 26.06,44.65 22.86,44.65 v19.36,48.16 | LED37.A 45.87,45.72 44.81,44.65 42.98,44.65 | 33.07,46.79 v32,47.85 | v17.22,48.16 15.85,46.79 | v60.35,52.88 60.35,45.72 | v44.96,63.4 44.96,58.83 42.98,56.84 42.98,44.65
  Bottom 0.152: v32,47.85 34.29,50.14 34.59,50.14 IC1.23 | v19.36,48.16 v17.22,48.16 | v60.35,52.88 59.89,52.88 49.38,63.4 v44.96,63.4
SEGDP  (via drill 0.35)
  Top 0.152: LED8.A 77.88,5.03 76.35,5.03 75.29,3.96 68.89,3.96 67.82,5.03 LED7.A 67.67,5.03 66.14,5.03 65.08,3.96 58.83,3.96 57.76,5.03 LED6.A 57.61,5.03 56.54,3.96 53.34,3.96 52.27,5.03 47.55,5.03 LED5.A 47.4,5.03 45.87,5.03 44.81,3.96 38.41,3.96 37.34,5.03 LED4.A 37.19,5.03 36.12,3.96 33.07,3.96 32,5.03 27.28,5.03 LED3.A 27.13,5.03 25.45,5.03 24.38,3.96 20.12,3.96 17.98,6.1 | LED1.A 6.86,5.03 11.58,5.03 12.65,3.96 15.85,3.96 16.92,5.03 LED2.A 17.07,5.18 17.98,6.1 | v25.15,43.43 25.15,39.01 17.98,31.85 17.98,6.1
  Bottom 0.152: v25.15,43.43 25.15,54.25 25.76,54.86 27.89,54.86 28.19,54.56 28.19,54.25 31.7,50.75 35.81,50.75 35.97,50.6 35.97,49.84 35.05,48.92 34.75,48.92 IC1.22
SEGE  (via drill 0.35)
  Top 0.152: LED48.A 77.88,55.78 76.96,54.86 73.61,54.86 72.69,55.78 67.82,55.78 LED47.A 67.67,55.93 66.14,55.93 65.08,57 58.83,57 57.76,55.93 LED46.A 57.61,55.93 56.54,57 53.34,57 52.27,55.93 v49.99,55.93 47.55,55.93 LED45.A | 15.85,57 12.65,57 11.58,55.93 6.86,55.93 LED41.A | 15.85,57 16.92,55.93 LED42.A | LED43.A 27.28,55.93 31.24,55.93 32.31,57 36.12,57 37.19,55.93 LED44.A | v35.51,53.65 35.51,54.1 37.19,55.78 LED44.A | v17.22,58.37 15.85,57 | v41.45,51.97 41.15,51.97 37.34,55.78 LED44.A
  Bottom 0.152: IC1.21 34.75,47.7 35.2,47.7 36.27,48.77 36.27,52.88 v35.51,53.65 30.79,58.37 v17.22,58.37 | v49.99,55.93 45.41,55.93 v41.45,51.97
SEGF  (via drill 0.35)
  Top 0.152: 47.55,68.58 47.55,71.48 53.34,77.27 55.02,77.27 56.54,75.74 56.54,75.13 | 47.55,68.58 47.55,66.14 LED53.A | 56.54,75.13 56.54,67.21 57.61,66.14 LED54.A | 67.67,74.22 67.67,74.37 65.38,76.66 65.38,76.96 65.08,77.27 60.66,77.27 58.52,75.13 56.54,75.13 | 67.67,74.22 67.67,66.14 LED55.A | 67.67,74.22 70.71,77.27 75.29,77.27 75.44,77.11 75.44,76.81 77.88,74.37 77.88,66.14 LED56.A | v10.97,66.14 6.86,66.14 LED49.A | LED50.A 16.92,66.14 15.24,67.82 v15.24,68.12 15.24,69.65 22.86,77.27 24.54,77.27 24.69,77.11 24.69,76.81 27.13,74.37 27.13,66.14 LED51.A | v34.75,68.58 37.19,66.14 LED52.A 37.34,66.14 v39.78,68.58 | v46.48,68.58 47.55,68.58
  Bottom 0.152: v10.97,66.14 13.26,66.14 v15.24,68.12 15.7,68.58 v34.75,68.58 36.58,66.75 36.58,46.63 35.66,45.72 33.68,45.72 33.38,45.41 33.38,44.65 33.53,44.5 35.66,44.5 35.97,44.2 35.97,40.84 35.2,40.08 34.75,40.08 IC1.15 | v39.78,68.58 v46.48,68.58
SEGG  (via drill 0.35)
  Top 0.152: LED64.A 76.81,76.2 75.44,77.57 69.19,77.57 67.82,76.2 LED63.A 66.6,76.2 65.23,77.57 59.13,77.57 57.76,76.2 LED62.A 57.61,76.2 56.24,77.57 53.19,77.57 51.82,76.2 LED61.A 46.33,76.2 44.96,77.57 38.71,77.57 37.34,76.2 LED60.A 37.19,76.2 35.2,78.18 v31.85,78.18 | LED57.A 11.58,76.2 12.65,77.27 15.85,77.27 16.92,76.2 LED58.A 20.88,76.2 v21.18,76.5 | 28.19,76.2 29.87,76.2 v30.63,76.96 | 28.19,76.2 LED59.A | v26.36,50.29 26.36,54.25 25.76,54.86 25.76,62.79 28.19,65.23 28.19,76.2
  Bottom 0.152: v31.85,78.18 v30.63,76.96 30.18,76.5 v21.18,76.5 | v26.36,50.29 33.98,42.67 34.59,42.67 IC1.17
VCC
  Bottom 0.152: 20.85,50.27 23.93,53.34 R1.2
  Bottom 0.3: IC2.16 34.82,13.23 34.29,12.7 C3.1
  Bottom 0.5: DATAIN.1 20.32,45.72 21.59,46.99 | 21.59,46.99 21.59,49.53 | DATAIN.2 20.32,43.18 21.59,44.45 | 21.59,44.45 21.59,46.99 | 21.59,44.45 21.59,43.18 21.59,41.91 20.32,40.64 DATAIN.3 | DATAOUT.1 71.12,45.72 73.66,48.26 73.66,44.45 | 73.66,44.45 72.39,43.18 DATAOUT.2 | DATAOUT.3 72.39,40.64 73.66,41.91 73.66,43.18 73.66,44.45 | C1.+ 38.1,54.74 C2.1 38.1,54.48 38.1,46.99 | 38.1,46.99 36.2,45.09 IC1.19 | 38.1,46.99 38.1,34.29 45.72,26.67 45.72,19.05 39.37,12.7 C3.1
  Bottom 2: 33.02,74.69 72.6,74.69 74.69,72.6 74.69,69.64 73.66,68.62 73.66,43.18 | 33.02,74.69 8.65,74.69 6.59,72.63 6.59,55.64 11.43,50.8 20.32,50.8 20.85,50.27 21.59,49.53 21.59,43.18 | C1.+ 38.1,69.61 33.02,74.69

### Text on the board
tNames: LED Matrix © JE Englund 2022 | Version 3.1
bNames: GND / / GND / / GND / / CLK | GND / / GND / / GND / / CLK | VCC / / VCC / / VCC / / LOAD / / DIN | VCC / / VCC / / VCC / / LOAD / / DOUT